# Altium project DIMM Tester and Programmer CS.PrjPcb
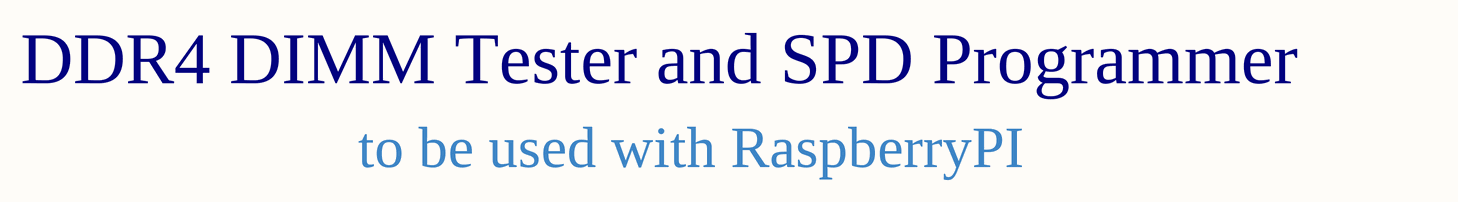
[diagram p0: DIMM Tester and Programmer.SchDoc]
3 sheets, 315 parts. Net scope: global (net labels, ports and power ports of the same name join across sheets).
Sheets:
  DIMM Tester and Programmer.SchDoc
  SPD Programmer.SchDoc
  Testpoints.SchDoc

## Sheet DIMM Tester and Programmer.SchDoc
size A3

### Notes on the sheet
- DDR4 DIMM Tester and SPD Programmer
- to be used with RaspberryPI

## Sheet SPD Programmer.SchDoc
size A3
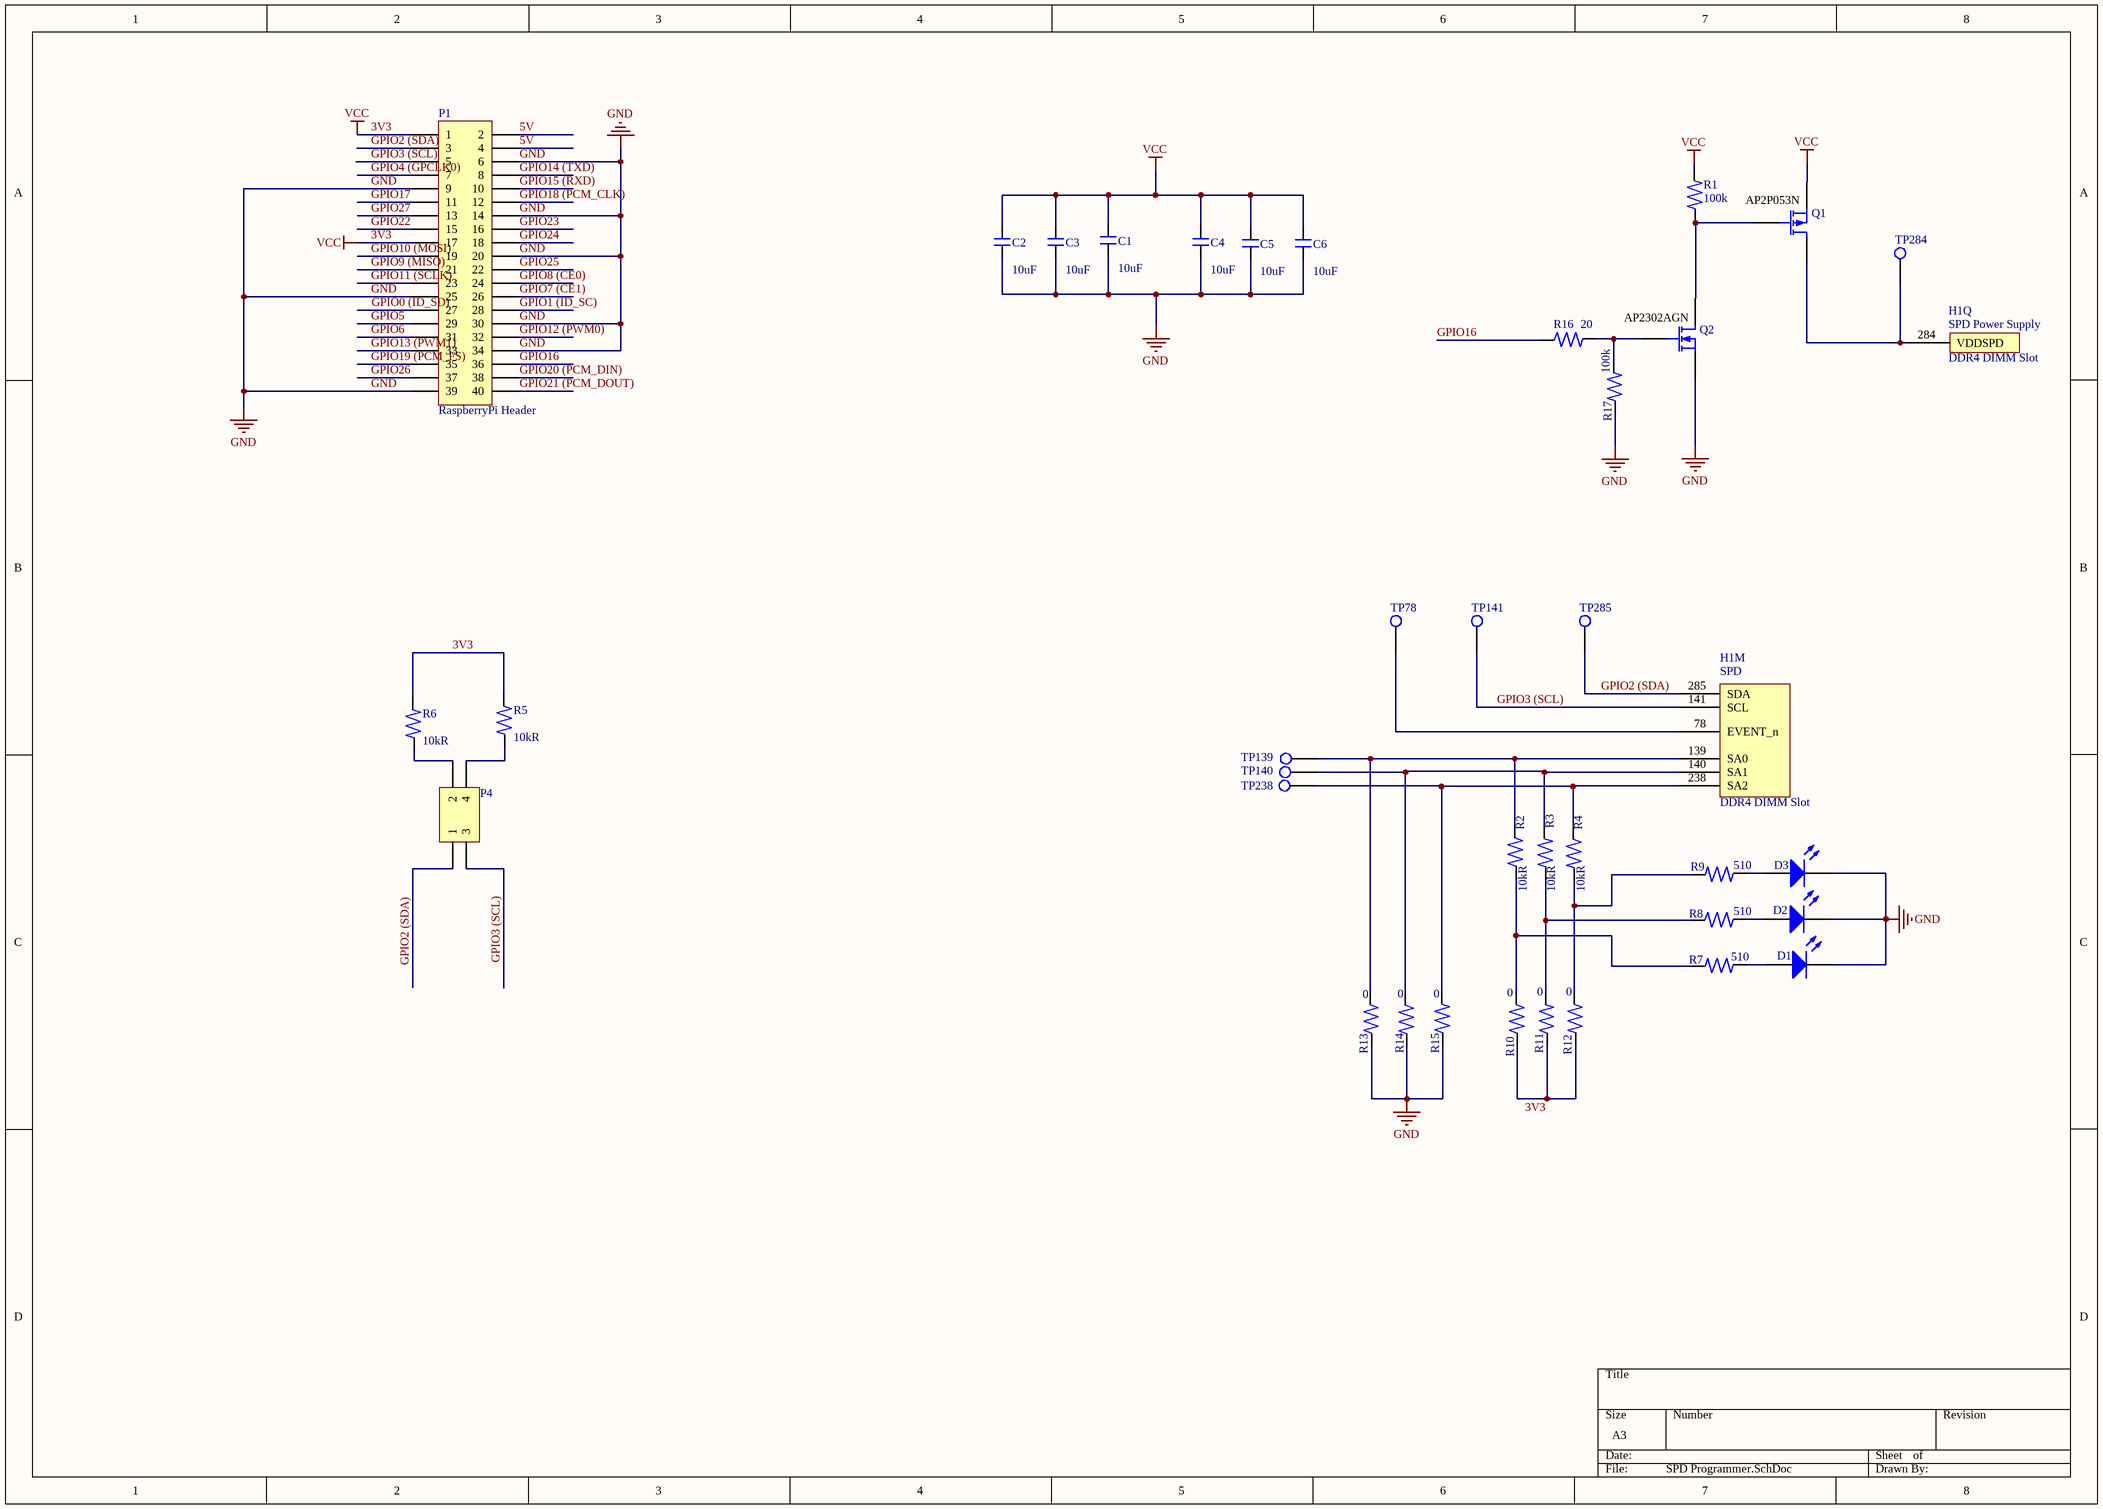
[diagram p1: SPD Programmer.SchDoc]

### Parts
C1  Capacitance: 10uF  [Capacitor 0603]  (hidden comment: Capacitor 0603)
C2  Capacitance: 10uF  [Capacitor 0603]  (hidden comment: Capacitor 0603)
C3  Capacitance: 10uF  [Capacitor 0603]  (hidden comment: Capacitor 0603)
C4  Capacitance: 10uF  [Capacitor 0603]  (hidden comment: Capacitor 0603)
C5  Capacitance: 10uF  [Capacitor 0603]  (hidden comment: Capacitor 0603)
C6  Capacitance: 10uF  [Capacitor 0603]  (hidden comment: Capacitor 0603)
D1  LED2  [3.2X1.6X1.1]  (value not drawn)
D2  LED2  [3.2X1.6X1.1]  (value not drawn)
D3  LED2  [3.2X1.6X1.1]  (value not drawn)
H1  DDR4 DIMM Slot  [DDR4 DIMM Slot]  (parts M,Q of 21)
P1  RaspberryPi Header  [HDR2X20]
P4  Header 2X2  [HDR2X2]  (value not drawn)
Q1  MOSFET-P  [SOT23]  (value not drawn)
Q2  MOSFET-N  [SOT23]  (value not drawn)
R1  Resistance: 100k  [Resistor 0603]  (hidden comment: Resistor 0603)
R2  Resistance: 10kR  [Resistor 0603]  (hidden comment: Resistor 0603)
R3  Resistance: 10kR  [Resistor 0603]  (hidden comment: Resistor 0603)
R4  Resistance: 10kR  [Resistor 0603]  (hidden comment: Resistor 0603)
R5  Resistance: 10kR  [Resistor 0603]  (hidden comment: Resistor 0603)
R6  Resistance: 10kR  [Resistor 0603]  (hidden comment: Resistor 0603)
R7  Resistance: 510  [Resistor 0603]  (hidden comment: Resistor 0603)
R8  Resistance: 510  [Resistor 0603]  (hidden comment: Resistor 0603)
R9  Resistance: 510  [Resistor 0603]  (hidden comment: Resistor 0603)
R10  Resistance: 0  [Resistor 0603]  (hidden comment: Resistor 0603)
R11  Resistance: 0  [Resistor 0603]  (hidden comment: Resistor 0603)
R12  Resistance: 0  [Resistor 0603]  (hidden comment: Resistor 0603)
R13  Resistance: 0  [Resistor 0603]  (hidden comment: Resistor 0603)
R14  Resistance: 0  [Resistor 0603]  (hidden comment: Resistor 0603)
R15  Resistance: 0  [Resistor 0603]  (hidden comment: Resistor 0603)
R16  Resistance: 20  [Resistor 0603]  (hidden comment: Resistor 0603)
R17  Resistance: 100k  [Resistor 0603]  (hidden comment: Resistor 0603)
TP78  Test Point  [Test Point]  (value not drawn)
TP139  Test Point  [Test Point]  (value not drawn)
TP140  Test Point  [Test Point]  (value not drawn)
TP141  Test Point  [Test Point]  (value not drawn)
TP238  Test Point  [Test Point]  (value not drawn)
TP284  Test Point  [Test Point]  (value not drawn)
TP285  Test Point  [Test Point]  (value not drawn)

### Nets
3V3: C1.2 C2.2 C3.2 C4.2 C5.2 C6.2 P1.1 P1.17 Q1.2(S) R1.2 R5.2 R6.2 R10.2 R11.2 R12.2  [also labelled VCC]
GND: C1.1 C2.1 C3.1 C4.1 C5.1 C6.1 D1.2(K) D2.2(K) D3.2(K) P1.6 P1.9 P1.14 P1.20 P1.25 P1.30 P1.34 P1.39 Q2.2(S) R13.2 R14.2 R15.2 R17.2
5V: P1.2 P1.4
GPIO0 (ID_SD): P1.27
GPIO1 (ID_SC): P1.28
GPIO2 (SDA): H1.285(SDA) P1.3 P4.1 TP285.1
GPIO3 (SCL): H1.141(SCL) P1.5 P4.3 TP141.1
GPIO4 (GPCLK0): P1.7
GPIO5: P1.29
GPIO6: P1.31
GPIO7 (CE1): P1.26
GPIO8 (CE0): P1.24
GPIO9 (MISO): P1.21
GPIO10 (MOSI): P1.19
GPIO11 (SCLK): P1.23
GPIO12 (PWM0): P1.32
GPIO13 (PWM1): P1.33
GPIO14 (TXD): P1.8
GPIO15 (RXD): P1.10
GPIO16: P1.36 R16.1
GPIO17: P1.11
GPIO18 (PCM_CLK): P1.12
GPIO19 (PCM_FS): P1.35
GPIO20 (PCM_DIN): P1.38
GPIO21 (PCM_DOUT): P1.40
GPIO22: P1.15
GPIO23: P1.16
GPIO24: P1.18
GPIO25: P1.22
GPIO26: P1.37
GPIO27: P1.13
NetD1_1: D1.1(A) R7.1
NetD2_1: D2.1(A) R8.1
NetD3_1: D3.1(A) R9.2
NetH1_78: H1.78(EVENT_n) TP78.1
NetH1_139: H1.139(SA0) R2.2 R13.1 TP139.1
NetH1_140: H1.140(SA1) R3.2 R14.1 TP140.1
NetH1_238: H1.238(SA2) R4.2 R15.1 TP238.1
NetH1_284: H1.284(VDDSPD) Q1.3(D) TP284.1
NetP4_2: P4.2 R6.1
NetP4_4: P4.4 R5.1
NetQ1_1: Q1.1(G) Q2.3(D) R1.1
NetQ2_1: Q2.1(G) R16.2 R17.1
NetR2_1: R2.1 R7.2 R10.1
NetR3_1: R3.1 R8.2 R11.1
NetR4_1: R4.1 R9.1 R12.1

### Notes on the sheet
- (near Q1) AP2P053N
- (near Q2) AP2302AGN
- (in symbol DDR4 DIMM Slot, part M) SPD
- (in symbol DDR4 DIMM Slot, part Q) SPD Power Supply

### Library data of the parts
C1-C6 = Capacitor 0603: Manufacturer: Vishay; Manufacturer Part Number: CRCW060310K0FKEA; Max Power Dissipation: 100mW; Tolerance: 1%; Voltage Rating: 75V; Temperature Coefficient: 100ppm/°C; Supplier 1: Avnet Europe; Stock 1: 305000; Pricing 1: 5000=0.00444, 10000=0.00432, 20000=0.00421, 30000=0.0041, 40000=0.004 (EUR); Case/Package: 0603; Number of Pins: 2; Weight: 7.1E-05oz; Contact Plating: Tin,Lead; Case Code (Metric): 1608; Case Code (Imperial): 0603; Min Operating Temperature: -55°C; Max Operating Temperature: 155°C; Packaging: Tape and Reel; Package Quantity: 10; Termination: SMD/SMT; Power Rating: 100mW; Composition: Thick Film; Number of Terminations: 2; Military Standard: Not; Voltage Rating (DC): 75V; Features: Automotive AEC-Q200; Length: 1.55mm; Height: 0.45mm; Width: 0.033inch; Depth: 0.85mm; Radiation Hardening: No; REACH SVHC: Unknown; Lead Free: Lead Free
D1-D3 = LED2: Typical RED, GREEN, YELLOW, AMBER GaAs LED; Published: 8-Jun-2000; LatestRevisionDate: 17-Jul-2002; LatestRevisionNote: Re-released for DXP Platform.; PackageVersion: Feb-2002; PackageReference: 3.2X1.6X1.1; Publisher: Altium Limited; PackageDescription: SM LED; 2 Flat Leads
P1 = Header 20X2: Header, 20-Pin, Dual row; LatestRevisionDate: 17-Jul-2002; LatestRevisionNote: Re-released for DXP Platform.; Publisher: Altium Limited
P4 = Header 2X2: Header, 2-Pin, Dual row; LatestRevisionDate: 17-Jul-2002; LatestRevisionNote: Re-released for DXP Platform.; Publisher: Altium Limited
Q1 = PMOS
Q2 = NMOS: Published: 8-Jun-2000; LatestRevisionDate: 17-Jul-2002; LatestRevisionNote: Re-released for DXP Platform.; PackageVersion: 1995/1996; PackageReference: E3; Publisher: Altium Limited; PackageDescription: TO, Flat Index; 3 In-Line, Axial Leads; Body Dia. 4.6mm; Lead Dia. 0.5 mm (max)
R1-R17 = Resistor 0603: Manufacturer: Vishay; Manufacturer Part Number: CRCW060310K0FKEA; Max Power Dissipation: 100mW; Tolerance: 1%; Voltage Rating: 75V; Temperature Coefficient: 100ppm/°C; Supplier 1: Avnet Europe; Stock 1: 305000; Pricing 1: 5000=0.00444, 10000=0.00432, 20000=0.00421, 30000=0.0041, 40000=0.004 (EUR); Case/Package: 0603; Number of Pins: 2; Weight: 7.1E-05oz; Contact Plating: Tin,Lead; Case Code (Metric): 1608; Case Code (Imperial): 0603; Min Operating Temperature: -55°C; Max Operating Temperature: 155°C; Packaging: Tape and Reel; Package Quantity: 10; Termination: SMD/SMT; Power Rating: 100mW; Composition: Thick Film; Number of Terminations: 2; Military Standard: Not; Voltage Rating (DC): 75V; Features: Automotive AEC-Q200; Length: 1.55mm; Height: 0.45mm; Width: 0.033inch; Depth: 0.85mm; Radiation Hardening: No; REACH SVHC: Unknown; Lead Free: Lead Free; ComponentLink1URL: http://www.vishay.com/docs/20008/dcrcw.pdf?src-supplier=Avnet+Europe; ComponentLink1Description: http://www.vishay.com/docs/20008/dcrcw.pdf?src-supplier=Avnet+Europe; ComponentLink2URL: https://www.verical.com/server-webapp/html/getDatasheet?partID=86831&src-supplier=Verical; ComponentLink2Description: https://www.verical.com/server-webapp/html/getDatasheet?partID=86831&src-supplier=Verical; ComponentLink3URL: http://www.farnell.com/datasheets/2310790.pdf?src-supplier=Allied+Electronics; ComponentLink3Description: http://www.farnell.com/datasheets/2310790.pdf?src-supplier=Allied+Electronics; ComponentLink4URL: http://www.vishay.com/docs/20035/dcrcwe3.pdf?src-supplier=Digi-Key; ComponentLink4Description: http://www.vishay.com/docs/20035/dcrcwe3.pdf?src-supplier=Digi-Key; ComponentLink5URL: http://www.farnell.com/datasheets/2310790.pdf?src-supplier=Mouser; ComponentLink5Description: http://www.farnell.com/datasheets/2310790.pdf?src-supplier=Mouser; ComponentLink6URL: http://www.farnell.com/datasheets/2310790.pdf?src-supplier=Element14; ComponentLink6Description: http://www.farnell.com/datasheets/2310790.pdf?src-supplier=Element14; ComponentLink7URL: http://www.farnell.com/datasheets/2310790.pdf?src-supplier=Avnet; ComponentLink7Description: http://www.farnell.com/datasheets/2310790.pdf?src-supplier=Avnet; ComponentLink8URL: http://www.vishay.com/docs/20035/dcrcwe3.pdf?src-supplier=Future+Electronics; ComponentLink8Description: http://www.vishay.com/docs/20035/dcrcwe3.pdf?src-supplier=Future+Electronics; ComponentLink9URL: http://uk.rs-online.com/webdocs/0d98/0900766b80d98afc.pdf?src-supplier=RSComponents; ComponentLink9Description: http://uk.rs-online.com/webdocs/0d98/0900766b80d98afc.pdf?src-supplier=RSComponents; ComponentLink10URL: http://www.farnell.com/datasheets/2310790.pdf?src-supplier=Distrelec; ComponentLink10Description: http://www.farnell.com/datasheets/2310790.pdf?src-supplier=Distrelec

## Sheet Testpoints.SchDoc
size A3
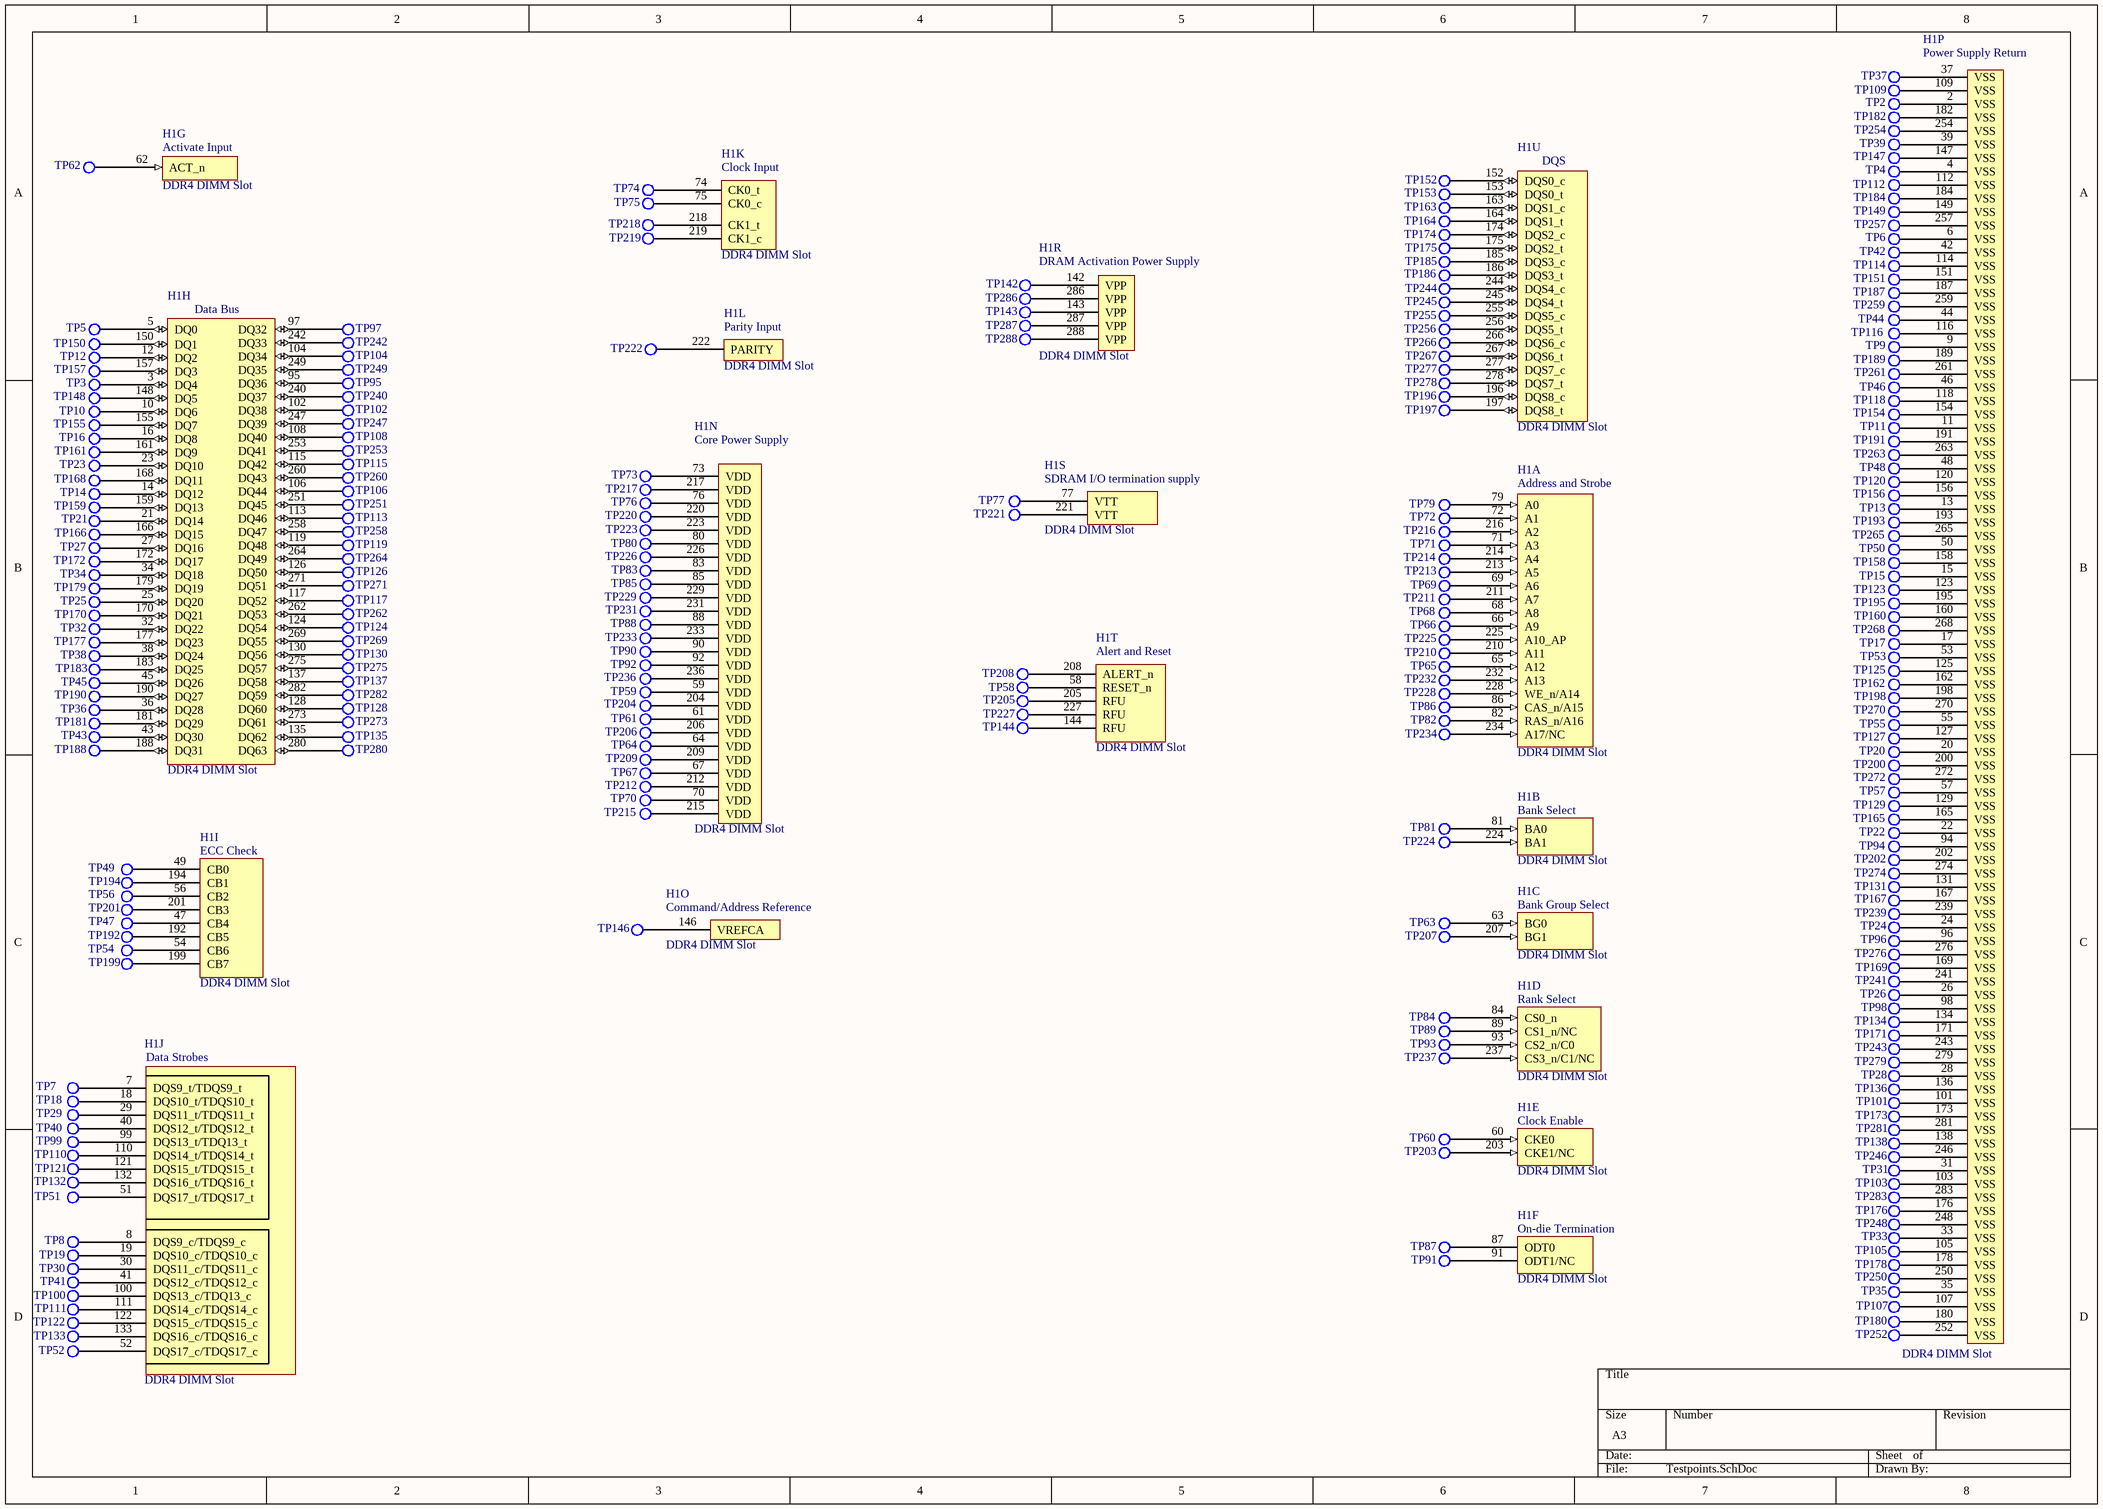
[diagram p2: Testpoints.SchDoc]

### Parts
H1  DDR4 DIMM Slot  [DDR4 DIMM Slot]  (parts A,B,C,D,E,F,G,H,I,J,K,L,N,O,P,R,S,T,U of 21)
TP2  Test Point  [Test Point]  (value not drawn)
TP3  Test Point  [Test Point]  (value not drawn)
TP4  Test Point  [Test Point]  (value not drawn)
TP5  Test Point  [Test Point]  (value not drawn)
TP6  Test Point  [Test Point]  (value not drawn)
TP7  Test Point  [Test Point]  (value not drawn)
TP8  Test Point  [Test Point]  (value not drawn)
TP9  Test Point  [Test Point]  (value not drawn)
TP10  Test Point  [Test Point]  (value not drawn)
TP11  Test Point  [Test Point]  (value not drawn)
TP12  Test Point  [Test Point]  (value not drawn)
TP13  Test Point  [Test Point]  (value not drawn)
TP14  Test Point  [Test Point]  (value not drawn)
TP15  Test Point  [Test Point]  (value not drawn)
TP16  Test Point  [Test Point]  (value not drawn)
TP17  Test Point  [Test Point]  (value not drawn)
TP18  Test Point  [Test Point]  (value not drawn)
TP19  Test Point  [Test Point]  (value not drawn)
TP20  Test Point  [Test Point]  (value not drawn)
TP21  Test Point  [Test Point]  (value not drawn)
TP22  Test Point  [Test Point]  (value not drawn)
TP23  Test Point  [Test Point]  (value not drawn)
TP24  Test Point  [Test Point]  (value not drawn)
TP25  Test Point  [Test Point]  (value not drawn)
TP26  Test Point  [Test Point]  (value not drawn)
TP27  Test Point  [Test Point]  (value not drawn)
TP28  Test Point  [Test Point]  (value not drawn)
TP29  Test Point  [Test Point]  (value not drawn)
TP30  Test Point  [Test Point]  (value not drawn)
TP31  Test Point  [Test Point]  (value not drawn)
TP32  Test Point  [Test Point]  (value not drawn)
TP33  Test Point  [Test Point]  (value not drawn)
TP34  Test Point  [Test Point]  (value not drawn)
TP35  Test Point  [Test Point]  (value not drawn)
TP36  Test Point  [Test Point]  (value not drawn)
TP37  Test Point  [Test Point]  (value not drawn)
TP38  Test Point  [Test Point]  (value not drawn)
TP39  Test Point  [Test Point]  (value not drawn)
TP40  Test Point  [Test Point]  (value not drawn)
TP41  Test Point  [Test Point]  (value not drawn)
TP42  Test Point  [Test Point]  (value not drawn)
TP43  Test Point  [Test Point]  (value not drawn)
TP44  Test Point  [Test Point]  (value not drawn)
TP45  Test Point  [Test Point]  (value not drawn)
TP46  Test Point  [Test Point]  (value not drawn)
TP47  Test Point  [Test Point]  (value not drawn)
TP48  Test Point  [Test Point]  (value not drawn)
TP49  Test Point  [Test Point]  (value not drawn)
TP50  Test Point  [Test Point]  (value not drawn)
TP51  Test Point  [Test Point]  (value not drawn)
TP52  Test Point  [Test Point]  (value not drawn)
TP53  Test Point  [Test Point]  (value not drawn)
TP54  Test Point  [Test Point]  (value not drawn)
TP55  Test Point  [Test Point]  (value not drawn)
TP56  Test Point  [Test Point]  (value not drawn)
TP57  Test Point  [Test Point]  (value not drawn)
TP58  Test Point  [Test Point]  (value not drawn)
TP59  Test Point  [Test Point]  (value not drawn)
TP60  Test Point  [Test Point]  (value not drawn)
TP61  Test Point  [Test Point]  (value not drawn)
TP62  Test Point  [Test Point]  (value not drawn)
TP63  Test Point  [Test Point]  (value not drawn)
TP64  Test Point  [Test Point]  (value not drawn)
TP65  Test Point  [Test Point]  (value not drawn)
TP66  Test Point  [Test Point]  (value not drawn)
TP67  Test Point  [Test Point]  (value not drawn)
TP68  Test Point  [Test Point]  (value not drawn)
TP69  Test Point  [Test Point]  (value not drawn)
TP70  Test Point  [Test Point]  (value not drawn)
TP71  Test Point  [Test Point]  (value not drawn)
TP72  Test Point  [Test Point]  (value not drawn)
TP73  Test Point  [Test Point]  (value not drawn)
TP74  Test Point  [Test Point]  (value not drawn)
TP75  Test Point  [Test Point]  (value not drawn)
TP76  Test Point  [Test Point]  (value not drawn)
TP77  Test Point  [Test Point]  (value not drawn)
TP79  Test Point  [Test Point]  (value not drawn)
TP80  Test Point  [Test Point]  (value not drawn)
TP81  Test Point  [Test Point]  (value not drawn)
TP82  Test Point  [Test Point]  (value not drawn)
TP83  Test Point  [Test Point]  (value not drawn)
TP84  Test Point  [Test Point]  (value not drawn)
TP85  Test Point  [Test Point]  (value not drawn)
TP86  Test Point  [Test Point]  (value not drawn)
TP87  Test Point  [Test Point]  (value not drawn)
TP88  Test Point  [Test Point]  (value not drawn)
TP89  Test Point  [Test Point]  (value not drawn)
TP90  Test Point  [Test Point]  (value not drawn)
TP91  Test Point  [Test Point]  (value not drawn)
TP92  Test Point  [Test Point]  (value not drawn)
TP93  Test Point  [Test Point]  (value not drawn)
TP94  Test Point  [Test Point]  (value not drawn)
TP95  Test Point  [Test Point]  (value not drawn)
TP96  Test Point  [Test Point]  (value not drawn)
TP97  Test Point  [Test Point]  (value not drawn)
TP98  Test Point  [Test Point]  (value not drawn)
TP99  Test Point  [Test Point]  (value not drawn)
TP100  Test Point  [Test Point]  (value not drawn)
TP101  Test Point  [Test Point]  (value not drawn)
TP102  Test Point  [Test Point]  (value not drawn)
TP103  Test Point  [Test Point]  (value not drawn)
TP104  Test Point  [Test Point]  (value not drawn)
TP105  Test Point  [Test Point]  (value not drawn)
TP106  Test Point  [Test Point]  (value not drawn)
TP107  Test Point  [Test Point]  (value not drawn)
TP108  Test Point  [Test Point]  (value not drawn)
TP109  Test Point  [Test Point]  (value not drawn)
TP110  Test Point  [Test Point]  (value not drawn)
TP111  Test Point  [Test Point]  (value not drawn)
TP112  Test Point  [Test Point]  (value not drawn)
TP113  Test Point  [Test Point]  (value not drawn)
TP114  Test Point  [Test Point]  (value not drawn)
TP115  Test Point  [Test Point]  (value not drawn)
TP116  Test Point  [Test Point]  (value not drawn)
TP117  Test Point  [Test Point]  (value not drawn)
TP118  Test Point  [Test Point]  (value not drawn)
TP119  Test Point  [Test Point]  (value not drawn)
TP120  Test Point  [Test Point]  (value not drawn)
TP121  Test Point  [Test Point]  (value not drawn)
TP122  Test Point  [Test Point]  (value not drawn)
TP123  Test Point  [Test Point]  (value not drawn)
TP124  Test Point  [Test Point]  (value not drawn)
TP125  Test Point  [Test Point]  (value not drawn)
TP126  Test Point  [Test Point]  (value not drawn)
TP127  Test Point  [Test Point]  (value not drawn)
TP128  Test Point  [Test Point]  (value not drawn)
TP129  Test Point  [Test Point]  (value not drawn)
TP130  Test Point  [Test Point]  (value not drawn)
TP131  Test Point  [Test Point]  (value not drawn)
TP132  Test Point  [Test Point]  (value not drawn)
TP133  Test Point  [Test Point]  (value not drawn)
TP134  Test Point  [Test Point]  (value not drawn)
TP135  Test Point  [Test Point]  (value not drawn)
TP136  Test Point  [Test Point]  (value not drawn)
TP137  Test Point  [Test Point]  (value not drawn)
TP138  Test Point  [Test Point]  (value not drawn)
TP142  Test Point  [Test Point]  (value not drawn)
TP143  Test Point  [Test Point]  (value not drawn)
TP144  Test Point  [Test Point]  (value not drawn)
TP146  Test Point  [Test Point]  (value not drawn)
TP147  Test Point  [Test Point]  (value not drawn)
TP148  Test Point  [Test Point]  (value not drawn)
TP149  Test Point  [Test Point]  (value not drawn)
TP150  Test Point  [Test Point]  (value not drawn)
TP151  Test Point  [Test Point]  (value not drawn)
TP152  Test Point  [Test Point]  (value not drawn)
TP153  Test Point  [Test Point]  (value not drawn)
TP154  Test Point  [Test Point]  (value not drawn)
TP155  Test Point  [Test Point]  (value not drawn)
TP156  Test Point  [Test Point]  (value not drawn)
TP157  Test Point  [Test Point]  (value not drawn)
TP158  Test Point  [Test Point]  (value not drawn)
TP159  Test Point  [Test Point]  (value not drawn)
TP160  Test Point  [Test Point]  (value not drawn)
TP161  Test Point  [Test Point]  (value not drawn)
TP162  Test Point  [Test Point]  (value not drawn)
TP163  Test Point  [Test Point]  (value not drawn)
TP164  Test Point  [Test Point]  (value not drawn)
TP165  Test Point  [Test Point]  (value not drawn)
TP166  Test Point  [Test Point]  (value not drawn)
TP167  Test Point  [Test Point]  (value not drawn)
TP168  Test Point  [Test Point]  (value not drawn)
TP169  Test Point  [Test Point]  (value not drawn)
TP170  Test Point  [Test Point]  (value not drawn)
TP171  Test Point  [Test Point]  (value not drawn)
TP172  Test Point  [Test Point]  (value not drawn)
TP173  Test Point  [Test Point]  (value not drawn)
TP174  Test Point  [Test Point]  (value not drawn)
TP175  Test Point  [Test Point]  (value not drawn)
TP176  Test Point  [Test Point]  (value not drawn)
TP177  Test Point  [Test Point]  (value not drawn)
TP178  Test Point  [Test Point]  (value not drawn)
TP179  Test Point  [Test Point]  (value not drawn)
TP180  Test Point  [Test Point]  (value not drawn)
TP181  Test Point  [Test Point]  (value not drawn)
TP182  Test Point  [Test Point]  (value not drawn)
TP183  Test Point  [Test Point]  (value not drawn)
TP184  Test Point  [Test Point]  (value not drawn)
TP185  Test Point  [Test Point]  (value not drawn)
TP186  Test Point  [Test Point]  (value not drawn)
TP187  Test Point  [Test Point]  (value not drawn)
TP188  Test Point  [Test Point]  (value not drawn)
TP189  Test Point  [Test Point]  (value not drawn)
TP190  Test Point  [Test Point]  (value not drawn)
TP191  Test Point  [Test Point]  (value not drawn)
TP192  Test Point  [Test Point]  (value not drawn)
TP193  Test Point  [Test Point]  (value not drawn)
TP194  Test Point  [Test Point]  (value not drawn)
TP195  Test Point  [Test Point]  (value not drawn)
TP196  Test Point  [Test Point]  (value not drawn)
TP197  Test Point  [Test Point]  (value not drawn)
TP198  Test Point  [Test Point]  (value not drawn)
TP199  Test Point  [Test Point]  (value not drawn)
TP200  Test Point  [Test Point]  (value not drawn)
TP201  Test Point  [Test Point]  (value not drawn)
TP202  Test Point  [Test Point]  (value not drawn)
TP203  Test Point  [Test Point]  (value not drawn)
TP204  Test Point  [Test Point]  (value not drawn)
TP205  Test Point  [Test Point]  (value not drawn)
TP206  Test Point  [Test Point]  (value not drawn)
TP207  Test Point  [Test Point]  (value not drawn)
TP208  Test Point  [Test Point]  (value not drawn)
TP209  Test Point  [Test Point]  (value not drawn)
TP210  Test Point  [Test Point]  (value not drawn)
TP211  Test Point  [Test Point]  (value not drawn)
TP212  Test Point  [Test Point]  (value not drawn)
TP213  Test Point  [Test Point]  (value not drawn)
TP214  Test Point  [Test Point]  (value not drawn)
TP215  Test Point  [Test Point]  (value not drawn)
TP216  Test Point  [Test Point]  (value not drawn)
TP217  Test Point  [Test Point]  (value not drawn)
TP218  Test Point  [Test Point]  (value not drawn)
TP219  Test Point  [Test Point]  (value not drawn)
TP220  Test Point  [Test Point]  (value not drawn)
TP221  Test Point  [Test Point]  (value not drawn)
TP222  Test Point  [Test Point]  (value not drawn)
TP223  Test Point  [Test Point]  (value not drawn)
TP224  Test Point  [Test Point]  (value not drawn)
TP225  Test Point  [Test Point]  (value not drawn)
TP226  Test Point  [Test Point]  (value not drawn)
TP227  Test Point  [Test Point]  (value not drawn)
TP228  Test Point  [Test Point]  (value not drawn)
TP229  Test Point  [Test Point]  (value not drawn)
TP231  Test Point  [Test Point]  (value not drawn)
TP232  Test Point  [Test Point]  (value not drawn)
TP233  Test Point  [Test Point]  (value not drawn)
TP234  Test Point  [Test Point]  (value not drawn)
TP236  Test Point  [Test Point]  (value not drawn)
TP237  Test Point  [Test Point]  (value not drawn)
TP239  Test Point  [Test Point]  (value not drawn)
TP240  Test Point  [Test Point]  (value not drawn)
TP241  Test Point  [Test Point]  (value not drawn)
TP242  Test Point  [Test Point]  (value not drawn)
TP243  Test Point  [Test Point]  (value not drawn)
TP244  Test Point  [Test Point]  (value not drawn)
TP245  Test Point  [Test Point]  (value not drawn)
TP246  Test Point  [Test Point]  (value not drawn)
TP247  Test Point  [Test Point]  (value not drawn)
TP248  Test Point  [Test Point]  (value not drawn)
TP249  Test Point  [Test Point]  (value not drawn)
TP250  Test Point  [Test Point]  (value not drawn)
TP251  Test Point  [Test Point]  (value not drawn)
TP252  Test Point  [Test Point]  (value not drawn)
TP253  Test Point  [Test Point]  (value not drawn)
TP254  Test Point  [Test Point]  (value not drawn)
TP255  Test Point  [Test Point]  (value not drawn)
TP256  Test Point  [Test Point]  (value not drawn)
TP257  Test Point  [Test Point]  (value not drawn)
TP258  Test Point  [Test Point]  (value not drawn)
TP259  Test Point  [Test Point]  (value not drawn)
TP260  Test Point  [Test Point]  (value not drawn)
TP261  Test Point  [Test Point]  (value not drawn)
TP262  Test Point  [Test Point]  (value not drawn)
TP263  Test Point  [Test Point]  (value not drawn)
TP264  Test Point  [Test Point]  (value not drawn)
TP265  Test Point  [Test Point]  (value not drawn)
TP266  Test Point  [Test Point]  (value not drawn)
TP267  Test Point  [Test Point]  (value not drawn)
TP268  Test Point  [Test Point]  (value not drawn)
TP269  Test Point  [Test Point]  (value not drawn)
TP270  Test Point  [Test Point]  (value not drawn)
TP271  Test Point  [Test Point]  (value not drawn)
TP272  Test Point  [Test Point]  (value not drawn)
TP273  Test Point  [Test Point]  (value not drawn)
TP274  Test Point  [Test Point]  (value not drawn)
TP275  Test Point  [Test Point]  (value not drawn)
TP276  Test Point  [Test Point]  (value not drawn)
TP277  Test Point  [Test Point]  (value not drawn)
TP278  Test Point  [Test Point]  (value not drawn)
TP279  Test Point  [Test Point]  (value not drawn)
TP280  Test Point  [Test Point]  (value not drawn)
TP281  Test Point  [Test Point]  (value not drawn)
TP282  Test Point  [Test Point]  (value not drawn)
TP283  Test Point  [Test Point]  (value not drawn)
TP286  Test Point  [Test Point]  (value not drawn)
TP287  Test Point  [Test Point]  (value not drawn)
TP288  Test Point  [Test Point]  (value not drawn)

### Nets
NetH1_2: H1.2(VSS) TP2.1
NetH1_3: H1.3(DQ4) TP3.1
NetH1_4: H1.4(VSS) TP4.1
NetH1_5: H1.5(DQ0) TP5.1
NetH1_6: H1.6(VSS) TP6.1
NetH1_7: H1.7(DQS9_t/TDQS9_t) TP7.1
NetH1_8: H1.8(DQS9_c/TDQS9_c) TP8.1
NetH1_9: H1.9(VSS) TP9.1
NetH1_10: H1.10(DQ6) TP10.1
NetH1_11: H1.11(VSS) TP11.1
NetH1_12: H1.12(DQ2) TP12.1
NetH1_13: H1.13(VSS) TP13.1
NetH1_14: H1.14(DQ12) TP14.1
NetH1_15: H1.15(VSS) TP15.1
NetH1_16: H1.16(DQ8) TP16.1
NetH1_17: H1.17(VSS) TP17.1
NetH1_18: H1.18(DQS10_t/TDQS10_t) TP18.1
NetH1_19: H1.19(DQS10_c/TDQS10_c) TP19.1
NetH1_20: H1.20(VSS) TP20.1
NetH1_21: H1.21(DQ14) TP21.1
NetH1_22: H1.22(VSS) TP22.1
NetH1_23: H1.23(DQ10) TP23.1
NetH1_24: H1.24(VSS) TP24.1
NetH1_25: H1.25(DQ20) TP25.1
NetH1_26: H1.26(VSS) TP26.1
NetH1_27: H1.27(DQ16) TP27.1
NetH1_28: H1.28(VSS) TP28.1
NetH1_29: H1.29(DQS11_t/TDQS11_t) TP29.1
NetH1_30: H1.30(DQS11_c/TDQS11_c) TP30.1
NetH1_31: H1.31(VSS) TP31.1
NetH1_32: H1.32(DQ22) TP32.1
NetH1_33: H1.33(VSS) TP33.1
NetH1_34: H1.34(DQ18) TP34.1
NetH1_35: H1.35(VSS) TP35.1
NetH1_36: H1.36(DQ28) TP36.1
NetH1_37: H1.37(VSS) TP37.1
NetH1_38: H1.38(DQ24) TP38.1
NetH1_39: H1.39(VSS) TP39.1
NetH1_40: H1.40(DQS12_t/TDQS12_t) TP40.1
NetH1_41: H1.41(DQS12_c/TDQS12_c) TP41.1
NetH1_42: H1.42(VSS) TP42.1
NetH1_43: H1.43(DQ30) TP43.1
NetH1_44: H1.44(VSS) TP44.1
NetH1_45: H1.45(DQ26) TP45.1
NetH1_46: H1.46(VSS) TP46.1
NetH1_47: H1.47(CB4) TP47.1
NetH1_48: H1.48(VSS) TP48.1
NetH1_49: H1.49(CB0) TP49.1
NetH1_50: H1.50(VSS) TP50.1
NetH1_51: H1.51(DQS17_t/TDQS17_t) TP51.1
NetH1_52: H1.52(DQS17_c/TDQS17_c) TP52.1
NetH1_53: H1.53(VSS) TP53.1
NetH1_54: H1.54(CB6) TP54.1
NetH1_55: H1.55(VSS) TP55.1
NetH1_56: H1.56(CB2) TP56.1
NetH1_57: H1.57(VSS) TP57.1
NetH1_58: H1.58(RESET_n) TP58.1
NetH1_59: H1.59(VDD) TP59.1
NetH1_60: H1.60(CKE0) TP60.1
NetH1_61: H1.61(VDD) TP61.1
NetH1_62: H1.62(ACT_n) TP62.1
NetH1_63: H1.63(BG0) TP63.1
NetH1_64: H1.64(VDD) TP64.1
NetH1_65: H1.65(A12) TP65.1
NetH1_66: H1.66(A9) TP66.1
NetH1_67: H1.67(VDD) TP67.1
NetH1_68: H1.68(A8) TP68.1
NetH1_69: H1.69(A6) TP69.1
NetH1_70: H1.70(VDD) TP70.1
NetH1_71: H1.71(A3) TP71.1
NetH1_72: H1.72(A1) TP72.1
NetH1_73: H1.73(VDD) TP73.1
NetH1_74: H1.74(CK0_t) TP74.1
NetH1_75: H1.75(CK0_c) TP75.1
NetH1_76: H1.76(VDD) TP76.1
NetH1_77: H1.77(VTT) TP77.1
NetH1_79: H1.79(A0) TP79.1
NetH1_80: H1.80(VDD) TP80.1
NetH1_81: H1.81(BA0) TP81.1
NetH1_82: H1.82(RAS_n/A16) TP82.1
NetH1_83: H1.83(VDD) TP83.1
NetH1_84: H1.84(CS0_n) TP84.1
NetH1_85: H1.85(VDD) TP85.1
NetH1_86: H1.86(CAS_n/A15) TP86.1
NetH1_87: H1.87(ODT0) TP87.1
NetH1_88: H1.88(VDD) TP88.1
NetH1_89: H1.89(CS1_n/NC) TP89.1
NetH1_90: H1.90(VDD) TP90.1
NetH1_91: H1.91(ODT1/NC) TP91.1
NetH1_92: H1.92(VDD) TP92.1
NetH1_93: H1.93(CS2_n/C0) TP93.1
NetH1_94: H1.94(VSS) TP94.1
NetH1_95: H1.95(DQ36) TP95.1
NetH1_96: H1.96(VSS) TP96.1
NetH1_97: H1.97(DQ32) TP97.1
NetH1_98: H1.98(VSS) TP98.1
NetH1_99: H1.99(DQS13_t/TDQ13_t) TP99.1
NetH1_100: H1.100(DQS13_c/TDQ13_c) TP100.1
NetH1_101: H1.101(VSS) TP101.1
NetH1_102: H1.102(DQ38) TP102.1
NetH1_103: H1.103(VSS) TP103.1
NetH1_104: H1.104(DQ34) TP104.1
NetH1_105: H1.105(VSS) TP105.1
NetH1_106: H1.106(DQ44) TP106.1
NetH1_107: H1.107(VSS) TP107.1
NetH1_108: H1.108(DQ40) TP108.1
NetH1_109: H1.109(VSS) TP109.1
NetH1_110: H1.110(DQS14_t/TDQS14_t) TP110.1
NetH1_111: H1.111(DQS14_c/TDQS14_c) TP111.1
NetH1_112: H1.112(VSS) TP112.1
NetH1_113: H1.113(DQ46) TP113.1
NetH1_114: H1.114(VSS) TP114.1
NetH1_115: H1.115(DQ42) TP115.1
NetH1_116: H1.116(VSS) TP116.1
NetH1_117: H1.117(DQ52) TP117.1
NetH1_118: H1.118(VSS) TP118.1
NetH1_119: H1.119(DQ48) TP119.1
NetH1_120: H1.120(VSS) TP120.1
NetH1_121: H1.121(DQS15_t/TDQS15_t) TP121.1
NetH1_122: H1.122(DQS15_c/TDQS15_c) TP122.1
NetH1_123: H1.123(VSS) TP123.1
NetH1_124: H1.124(DQ54) TP124.1
NetH1_125: H1.125(VSS) TP125.1
NetH1_126: H1.126(DQ50) TP126.1
NetH1_127: H1.127(VSS) TP127.1
NetH1_128: H1.128(DQ60) TP128.1
NetH1_129: H1.129(VSS) TP129.1
NetH1_130: H1.130(DQ56) TP130.1
NetH1_131: H1.131(VSS) TP131.1
NetH1_132: H1.132(DQS16_t/TDQS16_t) TP132.1
NetH1_133: H1.133(DQS16_c/TDQS16_c) TP133.1
NetH1_134: H1.134(VSS) TP134.1
NetH1_135: H1.135(DQ62) TP135.1
NetH1_136: H1.136(VSS) TP136.1
NetH1_137: H1.137(DQ58) TP137.1
NetH1_138: H1.138(VSS) TP138.1
NetH1_142: H1.142(VPP) TP142.1
NetH1_143: H1.143(VPP) TP143.1
NetH1_144: H1.144(RFU) TP144.1
NetH1_146: H1.146(VREFCA) TP146.1
NetH1_147: H1.147(VSS) TP147.1
NetH1_148: H1.148(DQ5) TP148.1
NetH1_149: H1.149(VSS) TP149.1
NetH1_150: H1.150(DQ1) TP150.1
NetH1_151: H1.151(VSS) TP151.1
NetH1_152: H1.152(DQS0_c) TP152.1
NetH1_153: H1.153(DQS0_t) TP153.1
NetH1_154: H1.154(VSS) TP154.1
NetH1_155: H1.155(DQ7) TP155.1
NetH1_156: H1.156(VSS) TP156.1
NetH1_157: H1.157(DQ3) TP157.1
NetH1_158: H1.158(VSS) TP158.1
NetH1_159: H1.159(DQ13) TP159.1
NetH1_160: H1.160(VSS) TP160.1
NetH1_161: H1.161(DQ9) TP161.1
NetH1_162: H1.162(VSS) TP162.1
NetH1_163: H1.163(DQS1_c) TP163.1
NetH1_164: H1.164(DQS1_t) TP164.1
NetH1_165: H1.165(VSS) TP165.1
NetH1_166: H1.166(DQ15) TP166.1
NetH1_167: H1.167(VSS) TP167.1
NetH1_168: H1.168(DQ11) TP168.1
NetH1_169: H1.169(VSS) TP169.1
NetH1_170: H1.170(DQ21) TP170.1
NetH1_171: H1.171(VSS) TP171.1
NetH1_172: H1.172(DQ17) TP172.1
NetH1_173: H1.173(VSS) TP173.1
NetH1_174: H1.174(DQS2_c) TP174.1
NetH1_175: H1.175(DQS2_t) TP175.1
NetH1_176: H1.176(VSS) TP176.1
NetH1_177: H1.177(DQ23) TP177.1
NetH1_178: H1.178(VSS) TP178.1
NetH1_179: H1.179(DQ19) TP179.1
NetH1_180: H1.180(VSS) TP180.1
NetH1_181: H1.181(DQ29) TP181.1
NetH1_182: H1.182(VSS) TP182.1
NetH1_183: H1.183(DQ25) TP183.1
NetH1_184: H1.184(VSS) TP184.1
NetH1_185: H1.185(DQS3_c) TP185.1
NetH1_186: H1.186(DQS3_t) TP186.1
NetH1_187: H1.187(VSS) TP187.1
NetH1_188: H1.188(DQ31) TP188.1
NetH1_189: H1.189(VSS) TP189.1
NetH1_190: H1.190(DQ27) TP190.1
NetH1_191: H1.191(VSS) TP191.1
NetH1_192: H1.192(CB5) TP192.1
NetH1_193: H1.193(VSS) TP193.1
NetH1_194: H1.194(CB1) TP194.1
NetH1_195: H1.195(VSS) TP195.1
NetH1_196: H1.196(DQS8_c) TP196.1
NetH1_197: H1.197(DQS8_t) TP197.1
NetH1_198: H1.198(VSS) TP198.1
NetH1_199: H1.199(CB7) TP199.1
NetH1_200: H1.200(VSS) TP200.1
NetH1_201: H1.201(CB3) TP201.1
NetH1_202: H1.202(VSS) TP202.1
NetH1_203: H1.203(CKE1/NC) TP203.1
NetH1_204: H1.204(VDD) TP204.1
NetH1_205: H1.205(RFU) TP205.1
NetH1_206: H1.206(VDD) TP206.1
NetH1_207: H1.207(BG1) TP207.1
NetH1_208: H1.208(ALERT_n) TP208.1
NetH1_209: H1.209(VDD) TP209.1
NetH1_210: H1.210(A11) TP210.1
NetH1_211: H1.211(A7) TP211.1
NetH1_212: H1.212(VDD) TP212.1
NetH1_213: H1.213(A5) TP213.1
NetH1_214: H1.214(A4) TP214.1
NetH1_215: H1.215(VDD) TP215.1
NetH1_216: H1.216(A2) TP216.1
NetH1_217: H1.217(VDD) TP217.1
NetH1_218: H1.218(CK1_t) TP218.1
NetH1_219: H1.219(CK1_c) TP219.1
NetH1_220: H1.220(VDD) TP220.1
NetH1_221: H1.221(VTT) TP221.1
NetH1_222: H1.222(PARITY) TP222.1
NetH1_223: H1.223(VDD) TP223.1
NetH1_224: H1.224(BA1) TP224.1
NetH1_225: H1.225(A10_AP) TP225.1
NetH1_226: H1.226(VDD) TP226.1
NetH1_227: H1.227(RFU) TP227.1
NetH1_228: H1.228(WE_n/A14) TP228.1
NetH1_229: H1.229(VDD) TP229.1
NetH1_231: H1.231(VDD) TP231.1
NetH1_232: H1.232(A13) TP232.1
NetH1_233: H1.233(VDD) TP233.1
NetH1_234: H1.234(A17/NC) TP234.1
NetH1_236: H1.236(VDD) TP236.1
NetH1_237: H1.237(CS3_n/C1/NC) TP237.1
NetH1_239: H1.239(VSS) TP239.1
NetH1_240: H1.240(DQ37) TP240.1
NetH1_241: H1.241(VSS) TP241.1
NetH1_242: H1.242(DQ33) TP242.1
NetH1_243: H1.243(VSS) TP243.1
NetH1_244: H1.244(DQS4_c) TP244.1
NetH1_245: H1.245(DQS4_t) TP245.1
NetH1_246: H1.246(VSS) TP246.1
NetH1_247: H1.247(DQ39) TP247.1
NetH1_248: H1.248(VSS) TP248.1
NetH1_249: H1.249(DQ35) TP249.1
NetH1_250: H1.250(VSS) TP250.1
NetH1_251: H1.251(DQ45) TP251.1
NetH1_252: H1.252(VSS) TP252.1
NetH1_253: H1.253(DQ41) TP253.1
NetH1_254: H1.254(VSS) TP254.1
NetH1_255: H1.255(DQS5_c) TP255.1
NetH1_256: H1.256(DQS5_t) TP256.1
NetH1_257: H1.257(VSS) TP257.1
NetH1_258: H1.258(DQ47) TP258.1
NetH1_259: H1.259(VSS) TP259.1
NetH1_260: H1.260(DQ43) TP260.1
NetH1_261: H1.261(VSS) TP261.1
NetH1_262: H1.262(DQ53) TP262.1
NetH1_263: H1.263(VSS) TP263.1
NetH1_264: H1.264(DQ49) TP264.1
NetH1_265: H1.265(VSS) TP265.1
NetH1_266: H1.266(DQS6_c) TP266.1
NetH1_267: H1.267(DQS6_t) TP267.1
NetH1_268: H1.268(VSS) TP268.1
NetH1_269: H1.269(DQ55) TP269.1
NetH1_270: H1.270(VSS) TP270.1
NetH1_271: H1.271(DQ51) TP271.1
NetH1_272: H1.272(VSS) TP272.1
NetH1_273: H1.273(DQ61) TP273.1
NetH1_274: H1.274(VSS) TP274.1
NetH1_275: H1.275(DQ57) TP275.1
NetH1_276: H1.276(VSS) TP276.1
NetH1_277: H1.277(DQS7_c) TP277.1
NetH1_278: H1.278(DQS7_t) TP278.1
NetH1_279: H1.279(VSS) TP279.1
NetH1_280: H1.280(DQ63) TP280.1
NetH1_281: H1.281(VSS) TP281.1
NetH1_282: H1.282(DQ59) TP282.1
NetH1_283: H1.283(VSS) TP283.1
NetH1_286: H1.286(VPP) TP286.1
NetH1_287: H1.287(VPP) TP287.1
NetH1_288: H1.288(VPP) TP288.1

### Notes on the sheet
- (in symbol DDR4 DIMM Slot, part A) Address and Strobe
- (in symbol DDR4 DIMM Slot, part B) Bank Select
- (in symbol DDR4 DIMM Slot, part C) Bank Group Select
- (in symbol DDR4 DIMM Slot, part D) Rank Select
- (in symbol DDR4 DIMM Slot, part E) Clock Enable
- (in symbol DDR4 DIMM Slot, part F) On-die Termination
- (in symbol DDR4 DIMM Slot, part G) Activate Input
- (in symbol DDR4 DIMM Slot, part H) Data Bus
- (in symbol DDR4 DIMM Slot, part I) ECC Check
- (in symbol DDR4 DIMM Slot, part J) Data Strobes
- (in symbol DDR4 DIMM Slot, part K) Clock Input
- (in symbol DDR4 DIMM Slot, part L) Parity Input
- (in symbol DDR4 DIMM Slot, part N) Core Power Supply
- (in symbol DDR4 DIMM Slot, part O) Command/Address Reference
- (in symbol DDR4 DIMM Slot, part P) Power Supply Return
- (in symbol DDR4 DIMM Slot, part R) DRAM Activation Power Supply
- (in symbol DDR4 DIMM Slot, part S) SDRAM I/O termination supply
- (in symbol DDR4 DIMM Slot, part T) Alert and Reset
- (in symbol DDR4 DIMM Slot, part U) DQS